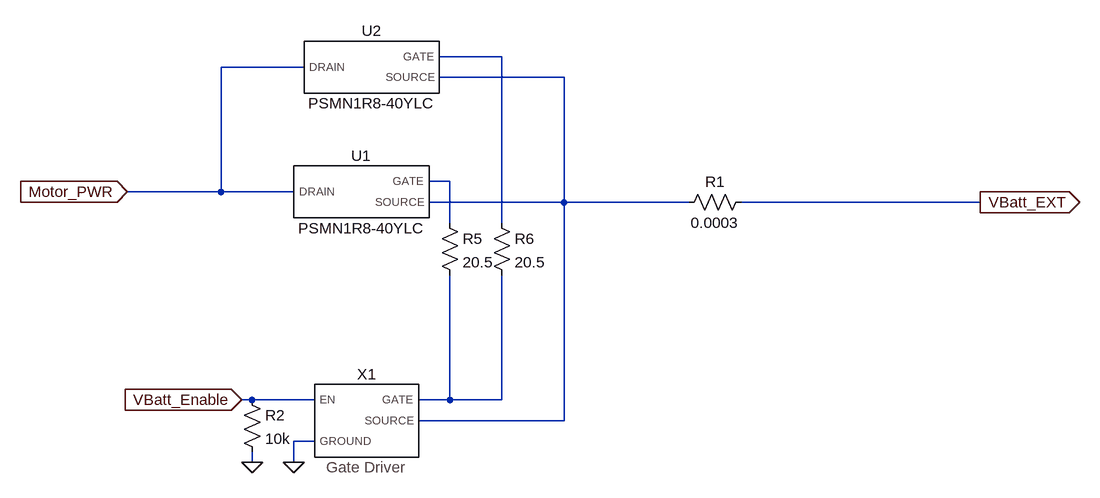
[diagram p0: schematic VBatt_simplified.asc]
VBatt_simplified.asc, the LTspice schematic file:
Version 4
SHEET 1 1784 680
WIRE 400 -128 304 -128
WIRE 96 -112 -32 -112
WIRE 496 -96 304 -96
WIRE 320 64 288 64
WIRE -32 80 -32 -112
WIRE -32 80 -176 80
WIRE 80 80 -32 80
WIRE 496 96 496 -96
WIRE 496 96 288 96
WIRE 688 96 496 96
WIRE 1136 96 768 96
WIRE 320 128 320 64
WIRE 400 128 400 -128
WIRE 16 400 0 400
WIRE 112 400 16 400
WIRE 320 400 320 208
WIRE 320 400 272 400
WIRE 400 400 400 208
WIRE 400 400 320 400
WIRE 496 432 496 96
WIRE 496 432 272 432
WIRE 112 464 80 464
WIRE 16 496 16 480
WIRE 80 496 80 464
FLAG -176 80 Motor_PWR
IOPIN -176 80 In
FLAG 1136 96 VBatt_EXT
IOPIN 1136 96 Out
FLAG 80 496 0
FLAG 0 400 VBatt_Enable
IOPIN 0 400 In
FLAG 16 496 0
DATAFLAG -32 0 ""
SYMBOL AutoGenerated\\PSMN1R8-40YLC 176 80 R0
SYMATTR InstName U1
SYMBOL AutoGenerated\\PSMN1R8-40YLC 192 -112 R0
SYMATTR InstName U2
SYMBOL res 784 80 R90
WINDOW 0 0 56 VBottom 2
WINDOW 3 32 56 VTop 2
SYMATTR InstName R1
SYMATTR Value 0.0003
SYMBOL res 304 112 R0
SYMATTR InstName R5
SYMATTR Value 20.5
SYMATTR SpiceLine tol=1
SYMBOL res 384 112 R0
SYMATTR InstName R6
SYMATTR Value 20.5
SYMATTR SpiceLine tol=1
SYMBOL gatedriver 192 432 R0
SYMATTR InstName X1
SYMBOL res 0 384 R0
SYMATTR InstName R2
SYMATTR Value 10k

The netlist it stands for:
* VBatt_simplified.asc
XU1 Motor_PWR N003 N002 PSMN1R8-40YLC  ; pins DRAIN GATE SOURCE
XU2 Motor_PWR N001 N002 PSMN1R8-40YLC  ; pins DRAIN GATE SOURCE
R1 VBatt_EXT N002 0.0003
R5 N003 N004 20.5 tol=1
R6 N001 N004 20.5 tol=1
XX1 VBatt_Enable N004 0 N002 gatedriver  ; pins EN GATE GROUND SOURCE
R2 VBatt_Enable 0 10k
.lib C:\Poorna\OneDrive - University of Victoria\University\2020\Summer 2020\ECE 499\Schematic\LTSpice\models\PSMN1R8-40YLC.lib
.backanno
.end